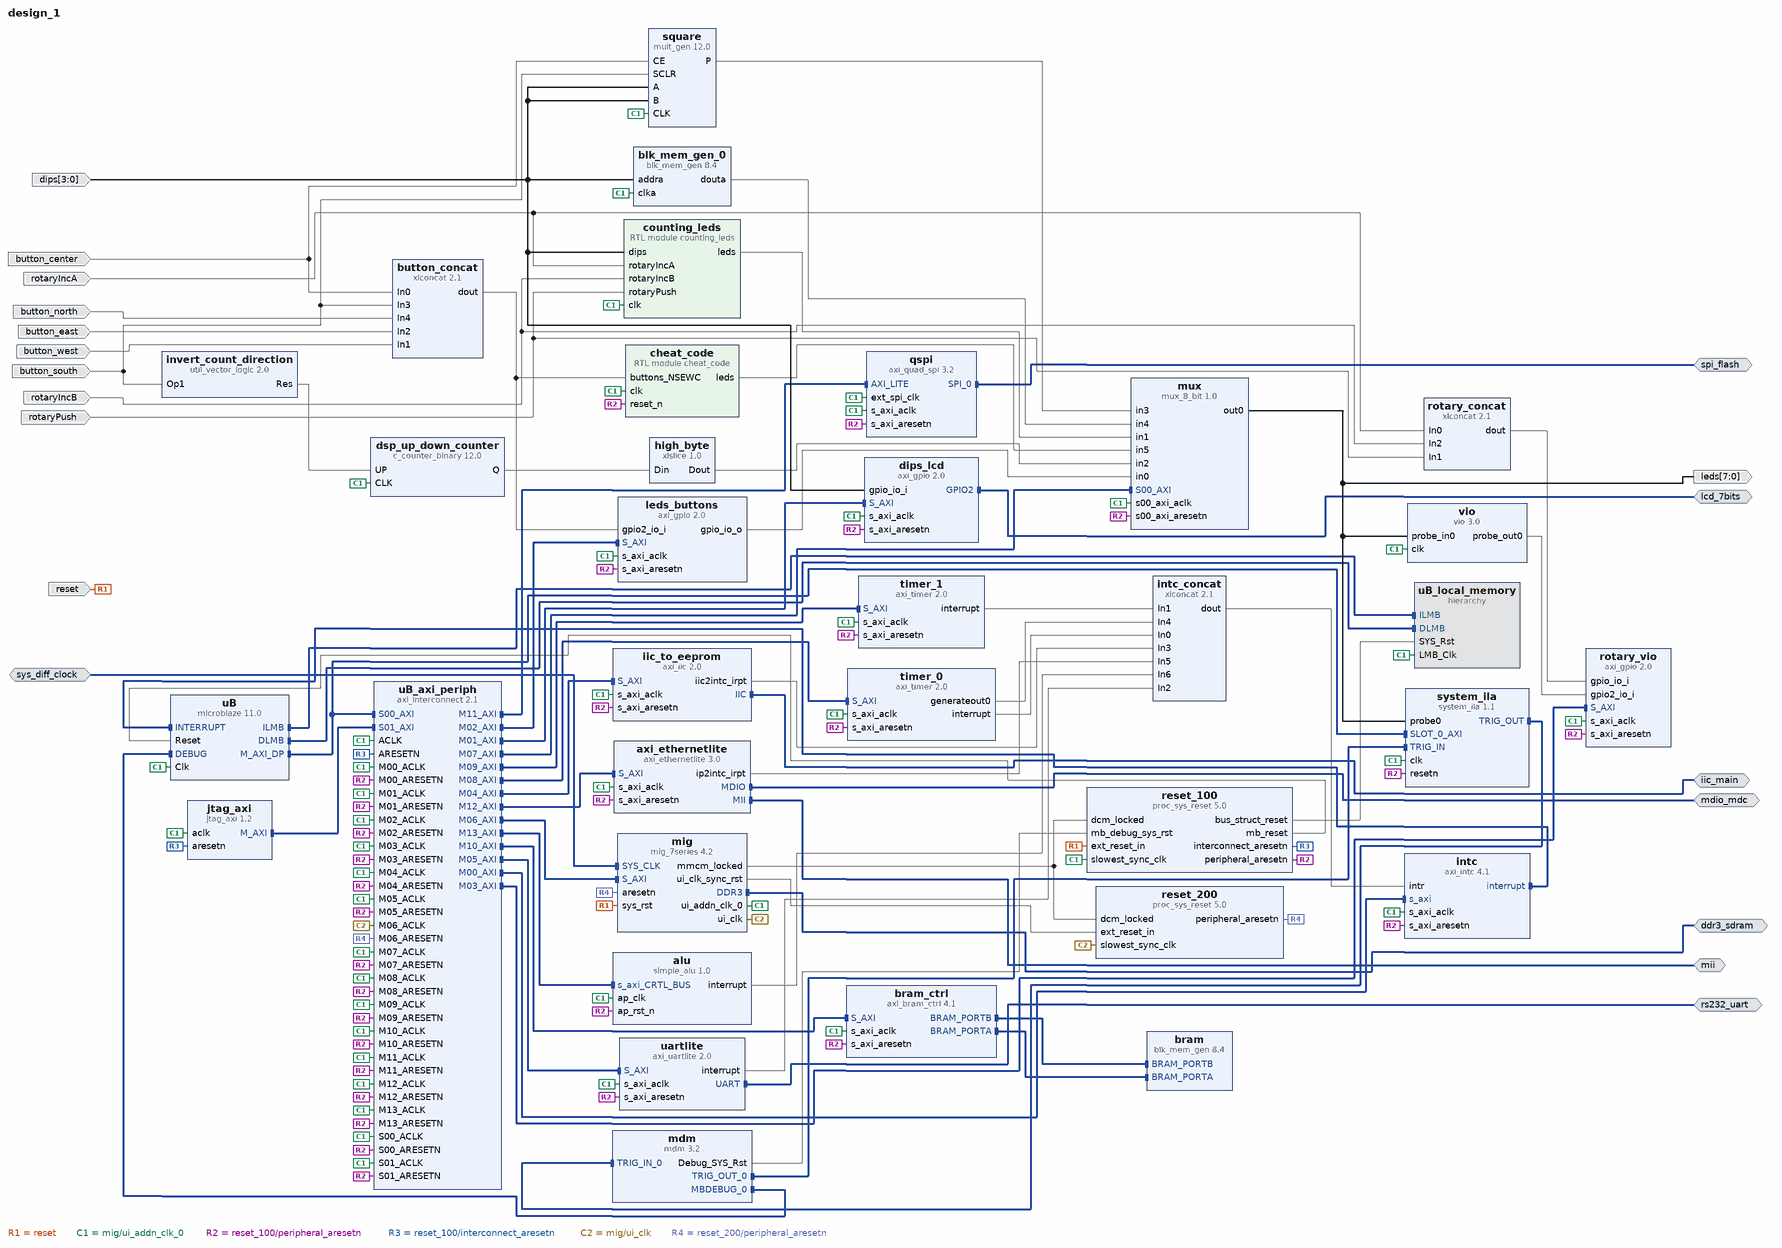
[diagram p0: block diagram of the top level]
# Vivado block design design_1, xc7k325tffg900-2, Vivado 2020.1
create_bd_design design_1

create_bd_intf_port -mode Master -vlnv xilinx.com:interface:gpio_rtl:1.0 lcd_7bits
create_bd_intf_port -mode Master -vlnv xilinx.com:interface:iic_rtl:1.0 iic_main
create_bd_intf_port -mode Master -vlnv xilinx.com:interface:uart_rtl:1.0 rs232_uart
create_bd_intf_port -mode Slave -vlnv xilinx.com:interface:diff_clock_rtl:1.0 sys_diff_clock
set_property -dict {CONFIG.FREQ_HZ 200000000} [get_bd_intf_ports sys_diff_clock]
create_bd_intf_port -mode Master -vlnv xilinx.com:interface:spi_rtl:1.0 spi_flash
create_bd_intf_port -mode Master -vlnv xilinx.com:interface:ddrx_rtl:1.0 ddr3_sdram
create_bd_intf_port -mode Master -vlnv xilinx.com:interface:mdio_rtl:1.0 mdio_mdc
create_bd_intf_port -mode Master -vlnv xilinx.com:interface:mii_rtl:1.0 mii
create_bd_port -dir I -type rst reset
set_property -dict {CONFIG.POLARITY ACTIVE_HIGH} [get_bd_ports reset]
create_bd_port -dir O -from 7 -to 0 leds
create_bd_port -dir I -from 3 -to 0 dips
create_bd_port -dir I rotaryIncA
create_bd_port -dir I rotaryIncB
create_bd_port -dir I rotaryPush
create_bd_port -dir I -type data button_south
create_bd_port -dir I -type data button_north
create_bd_port -dir I -type data button_east
create_bd_port -dir I button_west
create_bd_port -dir I -type data button_center

create_bd_cell -type ip -vlnv xilinx.com:ip:axi_gpio:2.0 dips_lcd
set_property -dict [list \
  CONFIG.GPIO2_BOARD_INTERFACE lcd_7bits \
  CONFIG.GPIO_BOARD_INTERFACE Custom \
  CONFIG.USE_BOARD_FLOW true \
] [get_bd_cells dips_lcd]
create_bd_cell -type ip -vlnv xilinx.com:ip:axi_gpio:2.0 leds_buttons
set_property -dict [list \
  CONFIG.GPIO2_BOARD_INTERFACE Custom \
  CONFIG.GPIO_BOARD_INTERFACE Custom \
  CONFIG.USE_BOARD_FLOW true \
] [get_bd_cells leds_buttons]
create_bd_cell -type ip -vlnv xilinx.com:ip:axi_iic:2.0 iic_to_eeprom
set_property -dict {CONFIG.IIC_BOARD_INTERFACE iic_main CONFIG.USE_BOARD_FLOW true} [get_bd_cells iic_to_eeprom]
create_bd_cell -type ip -vlnv xilinx.com:ip:axi_uartlite:2.0 uartlite
set_property -dict [list \
  CONFIG.C_BAUDRATE 115200 \
  CONFIG.UARTLITE_BOARD_INTERFACE rs232_uart \
  CONFIG.USE_BOARD_FLOW true \
] [get_bd_cells uartlite]
create_bd_cell -type ip -vlnv xilinx.com:ip:microblaze:11.0 uB
set_property -dict [list \
  CONFIG.C_ADDR_TAG_BITS 0 \
  CONFIG.C_DCACHE_ADDR_TAG 0 \
  CONFIG.C_DEBUG_ENABLED 2 \
  CONFIG.C_D_AXI 1 \
  CONFIG.C_D_LMB 1 \
  CONFIG.C_ENABLE_DISCRETE_PORTS 0 \
  CONFIG.C_I_LMB 1 \
  CONFIG.C_USE_BARREL 1 \
  CONFIG.C_USE_DCACHE 0 \
  CONFIG.C_USE_ICACHE 0 \
] [get_bd_cells uB]
create_bd_cell -type hier uB_local_memory
create_bd_cell -type ip -vlnv xilinx.com:ip:axi_interconnect:2.1 uB_axi_periph
set_property -dict {CONFIG.NUM_MI 14 CONFIG.NUM_SI 2} [get_bd_cells uB_axi_periph]
create_bd_cell -type ip -vlnv xilinx.com:ip:mdm:3.2 mdm
set_property -dict {CONFIG.C_ADDR_SIZE 32 CONFIG.C_M_AXI_ADDR_WIDTH 32 CONFIG.C_USE_CROSS_TRIGGER 1} [get_bd_cells mdm]
create_bd_cell -type ip -vlnv xilinx.com:ip:proc_sys_reset:5.0 reset_100
create_bd_cell -type ip -vlnv xilinx.com:ip:axi_timer:2.0 timer_0
create_bd_cell -type ip -vlnv xilinx.com:ip:axi_timer:2.0 timer_1
create_bd_cell -type ip -vlnv xilinx.com:ip:xlconcat:2.1 rotary_concat
set_property -dict {CONFIG.NUM_PORTS 3} [get_bd_cells rotary_concat]
create_bd_cell -type ip -vlnv xilinx.com:ip:axi_gpio:2.0 rotary_vio
set_property -dict [list \
  CONFIG.C_ALL_INPUTS 1 \
  CONFIG.C_ALL_INPUTS_2 1 \
  CONFIG.C_GPIO2_WIDTH 8 \
  CONFIG.C_GPIO_WIDTH 3 \
  CONFIG.C_IS_DUAL 1 \
] [get_bd_cells rotary_vio]
create_bd_cell -type ip -vlnv xilinx.com:ip:jtag_axi:1.2 jtag_axi
create_bd_cell -type ip -vlnv xilinx.com:ip:axi_bram_ctrl:4.1 bram_ctrl
create_bd_cell -type ip -vlnv xilinx.com:ip:blk_mem_gen:8.4 bram
set_property -dict {CONFIG.Memory_Type True_Dual_Port_RAM} [get_bd_cells bram]
create_bd_cell -type ip -vlnv xilinx.com:ip:axi_quad_spi:3.2 qspi
set_property -dict {CONFIG.QSPI_BOARD_INTERFACE spi_flash CONFIG.USE_BOARD_FLOW true} [get_bd_cells qspi]
create_bd_cell -type ip -vlnv xilinx.com:ip:axi_intc:4.1 intc
create_bd_cell -type ip -vlnv xilinx.com:ip:xlconcat:2.1 intc_concat
set_property -dict {CONFIG.NUM_PORTS 7} [get_bd_cells intc_concat]
create_bd_cell -type ip -vlnv xilinx.com:ip:mig_7series:4.2 mig
set_property -dict {CONFIG.BOARD_MIG_PARAM ddr3_sdram} [get_bd_cells mig]
create_bd_cell -type ip -vlnv xilinx.com:ip:proc_sys_reset:5.0 reset_200
set_property -dict [list \
  CONFIG.C_AUX_RESET_HIGH 0 \
  CONFIG.C_EXT_RST_WIDTH 4 \
  CONFIG.RESET_BOARD_INTERFACE Custom \
] [get_bd_cells reset_200]
create_bd_cell -type ip -vlnv xilinx.com:ip:vio:3.0 vio
set_property -dict [list \
  CONFIG.C_EN_PROBE_IN_ACTIVITY 0 \
  CONFIG.C_NUM_PROBE_IN 1 \
  CONFIG.C_NUM_PROBE_OUT 1 \
  CONFIG.C_PROBE_OUT0_INIT_VAL 0xA5 \
  CONFIG.C_PROBE_OUT0_WIDTH 8 \
] [get_bd_cells vio]
create_bd_cell -type ip -vlnv xilinx.com:ip:c_counter_binary:12.0 dsp_up_down_counter
set_property -dict [list \
  CONFIG.Count_Mode UPDOWN \
  CONFIG.Implementation DSP48 \
  CONFIG.Increment_Value 1 \
  CONFIG.Load false \
  CONFIG.Output_Width 32 \
  CONFIG.Restrict_Count false \
] [get_bd_cells dsp_up_down_counter]
create_bd_cell -type ip -vlnv xilinx.com:ip:xlslice:1.0 high_byte
set_property -dict {CONFIG.DIN_FROM 31 CONFIG.DIN_TO 24 CONFIG.DOUT_WIDTH 8} [get_bd_cells high_byte]
create_bd_cell -type ip -vlnv xilinx.com:ip:axi_ethernetlite:3.0 axi_ethernetlite
set_property -dict [list \
  CONFIG.C_INCLUDE_INTERNAL_LOOPBACK 1 \
  CONFIG.MDIO_BOARD_INTERFACE mdio_mdc \
  CONFIG.MII_BOARD_INTERFACE mii \
  CONFIG.USE_BOARD_FLOW true \
] [get_bd_cells axi_ethernetlite]
create_bd_cell -type ip -vlnv xilinx.com:ip:mult_gen:12.0 square
set_property -dict [list \
  CONFIG.ClockEnable true \
  CONFIG.MultType Parallel_Multiplier \
  CONFIG.Multiplier_Construction Use_Mults \
  CONFIG.PortAType Unsigned \
  CONFIG.PortAWidth 4 \
  CONFIG.PortBType Unsigned \
  CONFIG.PortBWidth 4 \
  CONFIG.SyncClear true \
] [get_bd_cells square]
create_bd_cell -type ip -vlnv xilinx.com:ip:xlconcat:2.1 button_concat
set_property -dict {CONFIG.NUM_PORTS 5} [get_bd_cells button_concat]
create_bd_cell -type ip -vlnv xilinx.com:ip:system_ila:1.1 system_ila
set_property -dict [list \
  CONFIG.ALL_PROBE_SAME_MU false \
  CONFIG.ALL_PROBE_SAME_MU_CNT 2 \
  CONFIG.C_ADV_TRIGGER true \
  CONFIG.C_EN_STRG_QUAL 1 \
  CONFIG.C_MON_TYPE MIX \
  CONFIG.C_NUM_MONITOR_SLOTS 1 \
  CONFIG.C_NUM_OF_PROBES 1 \
  CONFIG.C_PROBE0_MU_CNT 2 \
  CONFIG.C_PROBE0_WIDTH 8 \
  CONFIG.C_PROBE1_MU_CNT 2 \
  CONFIG.C_PROBE1_WIDTH 1 \
  CONFIG.C_PROBE_WIDTH_PROPAGATION MANUAL \
  CONFIG.C_SLOT 0 \
  CONFIG.C_SLOT_1_INTF_TYPE xilinx.com:interface:mii_rtl:1.0 \
  CONFIG.C_TRIGIN_EN true \
  CONFIG.C_TRIGOUT_EN true \
] [get_bd_cells system_ila]
create_bd_cell -type ip -vlnv xilinx.com:ip:util_vector_logic:2.0 invert_count_direction
set_property -dict {CONFIG.C_OPERATION not CONFIG.C_SIZE 1} [get_bd_cells invert_count_direction]
create_bd_cell -type ip -vlnv wbbinc.com:ip_repo:mux_8_bit:1.0 mux
create_bd_cell -type ip -vlnv wbbinc.com:simple-alu:simple_alu:1.0 alu
create_bd_cell -type ip -vlnv xilinx.com:ip:blk_mem_gen:8.4 blk_mem_gen_0
set_property -dict [list \
  CONFIG.Algorithm Fixed_Primitives \
  CONFIG.Coe_File ../../../../RTL/rom_data.coe \
  CONFIG.Enable_32bit_Address false \
  CONFIG.Enable_A Always_Enabled \
  CONFIG.Fill_Remaining_Memory_Locations true \
  CONFIG.Load_Init_File true \
  CONFIG.Memory_Type Single_Port_ROM \
  CONFIG.Port_A_Write_Rate 0 \
  CONFIG.Primitive 2kx9 \
  CONFIG.Register_PortA_Output_of_Memory_Primitives true \
  CONFIG.Use_RSTA_Pin false \
  CONFIG.Write_Depth_A 16 \
  CONFIG.Write_Width_A 8 \
  CONFIG.use_bram_block Stand_Alone \
] [get_bd_cells blk_mem_gen_0]
create_bd_cell -type module -reference counting_leds counting_leds
create_bd_cell -type module -reference cheat_code cheat_code

# ---- hierarchy /uB_local_memory ----
current_bd_instance /uB_local_memory
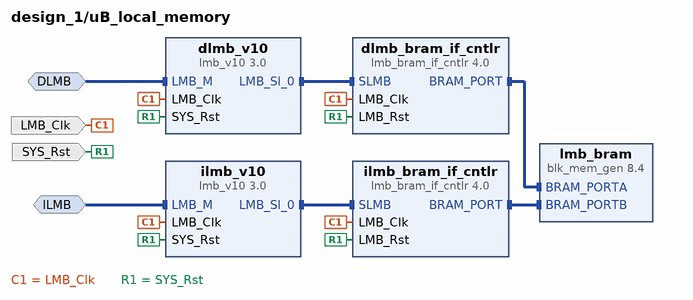
[diagram p1: block diagram inside /uB_local_memory]
create_bd_intf_pin -mode MirroredMaster -vlnv xilinx.com:interface:lmb_rtl:1.0 DLMB
create_bd_intf_pin -mode MirroredMaster -vlnv xilinx.com:interface:lmb_rtl:1.0 ILMB
create_bd_pin -dir I -type clk LMB_Clk
create_bd_pin -dir I -type rst SYS_Rst

create_bd_cell -type ip -vlnv xilinx.com:ip:lmb_v10:3.0 dlmb_v10
create_bd_cell -type ip -vlnv xilinx.com:ip:lmb_v10:3.0 ilmb_v10
create_bd_cell -type ip -vlnv xilinx.com:ip:lmb_bram_if_cntlr:4.0 dlmb_bram_if_cntlr
set_property -dict {CONFIG.C_ECC 0} [get_bd_cells dlmb_bram_if_cntlr]
create_bd_cell -type ip -vlnv xilinx.com:ip:lmb_bram_if_cntlr:4.0 ilmb_bram_if_cntlr
set_property -dict {CONFIG.C_ECC 0} [get_bd_cells ilmb_bram_if_cntlr]
create_bd_cell -type ip -vlnv xilinx.com:ip:blk_mem_gen:8.4 lmb_bram
set_property -dict {CONFIG.Memory_Type True_Dual_Port_RAM CONFIG.use_bram_block BRAM_Controller} [get_bd_cells lmb_bram]

# ---- connections ----

current_bd_instance /uB_local_memory
connect_bd_intf_net -intf_net microblaze_0_ilmb [get_bd_intf_pins ILMB] [get_bd_intf_pins ilmb_v10/LMB_M]
connect_bd_intf_net -intf_net microblaze_0_ilmb_cntlr [get_bd_intf_pins ilmb_bram_if_cntlr/BRAM_PORT] [get_bd_intf_pins lmb_bram/BRAM_PORTB]
connect_bd_intf_net -intf_net microblaze_0_dlmb_bus [get_bd_intf_pins dlmb_v10/LMB_Sl_0] [get_bd_intf_pins dlmb_bram_if_cntlr/SLMB]
connect_bd_intf_net -intf_net microblaze_0_dlmb_cntlr [get_bd_intf_pins dlmb_bram_if_cntlr/BRAM_PORT] [get_bd_intf_pins lmb_bram/BRAM_PORTA]
connect_bd_intf_net -intf_net microblaze_0_ilmb_bus [get_bd_intf_pins ilmb_v10/LMB_Sl_0] [get_bd_intf_pins ilmb_bram_if_cntlr/SLMB]
connect_bd_intf_net -intf_net microblaze_0_dlmb [get_bd_intf_pins DLMB] [get_bd_intf_pins dlmb_v10/LMB_M]
connect_bd_net -net microblaze_0_Clk [get_bd_pins LMB_Clk] \
  [get_bd_pins dlmb_v10/LMB_Clk] [get_bd_pins dlmb_bram_if_cntlr/LMB_Clk] [get_bd_pins ilmb_v10/LMB_Clk] \
  [get_bd_pins ilmb_bram_if_cntlr/LMB_Clk]
connect_bd_net [get_bd_pins SYS_Rst] \
  [get_bd_pins dlmb_v10/SYS_Rst] [get_bd_pins dlmb_bram_if_cntlr/LMB_Rst] [get_bd_pins ilmb_v10/SYS_Rst] \
  [get_bd_pins ilmb_bram_if_cntlr/LMB_Rst]
set_property HDL_ATTRIBUTE.BMM_INFO_ADDRESS_SPACE {byte  0x00000000 32 > design_1 uB_local_memory/lmb_bram} [get_bd_cells dlmb_bram_if_cntlr]
set_property HDL_ATTRIBUTE.KEEP_HIERARCHY yes [get_bd_cells dlmb_bram_if_cntlr]

current_bd_instance /
connect_bd_intf_net -intf_net axi_iic_0_IIC [get_bd_intf_ports iic_main] [get_bd_intf_pins iic_to_eeprom/IIC]
connect_bd_intf_net -intf_net axi_gpio_0_GPIO2 [get_bd_intf_ports lcd_7bits] [get_bd_intf_pins dips_lcd/GPIO2]
connect_bd_intf_net -intf_net microblaze_0_ilmb_1 [get_bd_intf_pins uB/ILMB] [get_bd_intf_pins uB_local_memory/ILMB]
connect_bd_intf_net -intf_net microblaze_0_dlmb_1 [get_bd_intf_pins uB/DLMB] [get_bd_intf_pins uB_local_memory/DLMB]
connect_bd_intf_net [get_bd_intf_pins uB_axi_periph/M09_AXI] [get_bd_intf_pins timer_1/S_AXI]
connect_bd_intf_net [get_bd_intf_pins uB_axi_periph/M11_AXI] [get_bd_intf_pins qspi/AXI_LITE]
connect_bd_intf_net -intf_net jtag_axi_0_M_AXI [get_bd_intf_pins jtag_axi/M_AXI] [get_bd_intf_pins uB_axi_periph/S01_AXI]
connect_bd_intf_net -intf_net system_ila_0_TRIG_OUT [get_bd_intf_pins mdm/TRIG_IN_0] [get_bd_intf_pins system_ila/TRIG_OUT]
connect_bd_intf_net -intf_net axi_intc_0_interrupt [get_bd_intf_pins intc/interrupt] [get_bd_intf_pins uB/INTERRUPT]
connect_bd_intf_net [get_bd_intf_pins uB_axi_periph/M13_AXI] [get_bd_intf_pins alu/s_axi_CRTL_BUS]
connect_bd_intf_net [get_bd_intf_pins uB_axi_periph/M07_AXI] [get_bd_intf_pins mux/S00_AXI]
connect_bd_intf_net -intf_net axi_ethernetlite_0_MDIO [get_bd_intf_ports mdio_mdc] [get_bd_intf_pins axi_ethernetlite/MDIO]
connect_bd_intf_net [get_bd_intf_pins mdm/TRIG_OUT_0] [get_bd_intf_pins system_ila/TRIG_IN]
connect_bd_intf_net [get_bd_intf_pins uB_axi_periph/M06_AXI] [get_bd_intf_pins mig/S_AXI]
connect_bd_intf_net [get_bd_intf_pins uB_axi_periph/M00_AXI] [get_bd_intf_pins intc/s_axi]
connect_bd_intf_net [get_bd_intf_ports sys_diff_clock] [get_bd_intf_pins mig/SYS_CLK]
connect_bd_intf_net [get_bd_intf_pins uB_axi_periph/M04_AXI] [get_bd_intf_pins iic_to_eeprom/S_AXI]
connect_bd_intf_net [get_bd_intf_pins uB_axi_periph/M08_AXI] [get_bd_intf_pins timer_0/S_AXI]
connect_bd_intf_net -intf_net axi_uartlite_0_UART [get_bd_intf_ports rs232_uart] [get_bd_intf_pins uartlite/UART]
connect_bd_intf_net [get_bd_intf_pins uB_axi_periph/M01_AXI] [get_bd_intf_pins dips_lcd/S_AXI]
connect_bd_intf_net -intf_net microblaze_0_debug [get_bd_intf_pins mdm/MBDEBUG_0] [get_bd_intf_pins uB/DEBUG]
connect_bd_intf_net -intf_net microblaze_0_axi_dp [get_bd_intf_pins uB_axi_periph/S00_AXI] [get_bd_intf_pins uB/M_AXI_DP]
connect_bd_intf_net [get_bd_intf_pins uB_axi_periph/S00_AXI] [get_bd_intf_pins system_ila/SLOT_0_AXI]
connect_bd_intf_net [get_bd_intf_pins uB_axi_periph/M03_AXI] [get_bd_intf_pins rotary_vio/S_AXI]
connect_bd_intf_net -intf_net axi_bram_ctrl_0_BRAM_PORTB [get_bd_intf_pins bram/BRAM_PORTB] [get_bd_intf_pins bram_ctrl/BRAM_PORTB]
connect_bd_intf_net -intf_net axi_bram_ctrl_0_BRAM_PORTA [get_bd_intf_pins bram/BRAM_PORTA] [get_bd_intf_pins bram_ctrl/BRAM_PORTA]
connect_bd_intf_net -intf_net mig_7series_0_DDR3 [get_bd_intf_ports ddr3_sdram] [get_bd_intf_pins mig/DDR3]
connect_bd_intf_net [get_bd_intf_pins uB_axi_periph/M12_AXI] [get_bd_intf_pins axi_ethernetlite/S_AXI]
connect_bd_intf_net [get_bd_intf_ports mii] [get_bd_intf_pins axi_ethernetlite/MII]
connect_bd_intf_net -intf_net axi_quad_spi_0_SPI_0 [get_bd_intf_ports spi_flash] [get_bd_intf_pins qspi/SPI_0]
connect_bd_intf_net [get_bd_intf_pins uB_axi_periph/M10_AXI] [get_bd_intf_pins bram_ctrl/S_AXI]
connect_bd_intf_net [get_bd_intf_pins uB_axi_periph/M05_AXI] [get_bd_intf_pins uartlite/S_AXI]
connect_bd_intf_net [get_bd_intf_pins uB_axi_periph/M02_AXI] [get_bd_intf_pins leds_buttons/S_AXI]
connect_bd_net [get_bd_ports reset] [get_bd_pins reset_100/ext_reset_in] [get_bd_pins mig/sys_rst]
connect_bd_net -net microblaze_0_Clk_1 [get_bd_pins mig/ui_addn_clk_0] \
  [get_bd_pins uB/Clk] [get_bd_pins uB_axi_periph/ACLK] [get_bd_pins uB_axi_periph/S00_ACLK] \
  [get_bd_pins uB_axi_periph/M00_ACLK] [get_bd_pins uB_local_memory/LMB_Clk] [get_bd_pins reset_100/slowest_sync_clk] \
  [get_bd_pins dips_lcd/s_axi_aclk] [get_bd_pins leds_buttons/s_axi_aclk] [get_bd_pins uartlite/s_axi_aclk] \
  [get_bd_pins iic_to_eeprom/s_axi_aclk] [get_bd_pins uB_axi_periph/M01_ACLK] [get_bd_pins uB_axi_periph/M02_ACLK] \
  [get_bd_pins uB_axi_periph/M03_ACLK] [get_bd_pins uB_axi_periph/M04_ACLK] [get_bd_pins uB_axi_periph/M05_ACLK] \
  [get_bd_pins uB_axi_periph/S01_ACLK] [get_bd_pins uB_axi_periph/M07_ACLK] [get_bd_pins timer_0/s_axi_aclk] \
  [get_bd_pins uB_axi_periph/M08_ACLK] [get_bd_pins timer_1/s_axi_aclk] [get_bd_pins uB_axi_periph/M09_ACLK] \
  [get_bd_pins rotary_vio/s_axi_aclk] [get_bd_pins jtag_axi/aclk] [get_bd_pins bram_ctrl/s_axi_aclk] \
  [get_bd_pins uB_axi_periph/M10_ACLK] [get_bd_pins uB_axi_periph/M11_ACLK] [get_bd_pins qspi/s_axi_aclk] \
  [get_bd_pins qspi/ext_spi_clk] [get_bd_pins intc/s_axi_aclk] [get_bd_pins vio/clk] [get_bd_pins dsp_up_down_counter/CLK] \
  [get_bd_pins axi_ethernetlite/s_axi_aclk] [get_bd_pins uB_axi_periph/M12_ACLK] [get_bd_pins square/CLK] \
  [get_bd_pins system_ila/clk] [get_bd_pins uB_axi_periph/M13_ACLK] [get_bd_pins mux/s00_axi_aclk] [get_bd_pins alu/ap_clk] \
  [get_bd_pins blk_mem_gen_0/clka] [get_bd_pins counting_leds/clk] [get_bd_pins cheat_code/clk]
connect_bd_net -net rst_clk_wiz_0_100M_mb_reset [get_bd_pins reset_100/mb_reset] [get_bd_pins uB/Reset]
connect_bd_net -net rst_clk_wiz_0_100M_bus_struct_reset [get_bd_pins reset_100/bus_struct_reset] [get_bd_pins uB_local_memory/SYS_Rst]
connect_bd_net -net rst_clk_wiz_0_100M_peripheral_aresetn1 [get_bd_pins reset_100/peripheral_aresetn] \
  [get_bd_pins uB_axi_periph/S00_ARESETN] [get_bd_pins uB_axi_periph/M00_ARESETN] [get_bd_pins dips_lcd/s_axi_aresetn] \
  [get_bd_pins leds_buttons/s_axi_aresetn] [get_bd_pins uartlite/s_axi_aresetn] [get_bd_pins iic_to_eeprom/s_axi_aresetn] \
  [get_bd_pins uB_axi_periph/M01_ARESETN] [get_bd_pins uB_axi_periph/M02_ARESETN] [get_bd_pins uB_axi_periph/M03_ARESETN] \
  [get_bd_pins uB_axi_periph/M04_ARESETN] [get_bd_pins uB_axi_periph/M05_ARESETN] [get_bd_pins uB_axi_periph/S01_ARESETN] \
  [get_bd_pins uB_axi_periph/M07_ARESETN] [get_bd_pins timer_0/s_axi_aresetn] [get_bd_pins uB_axi_periph/M08_ARESETN] \
  [get_bd_pins timer_1/s_axi_aresetn] [get_bd_pins uB_axi_periph/M09_ARESETN] [get_bd_pins rotary_vio/s_axi_aresetn] \
  [get_bd_pins bram_ctrl/s_axi_aresetn] [get_bd_pins uB_axi_periph/M10_ARESETN] [get_bd_pins uB_axi_periph/M11_ARESETN] \
  [get_bd_pins qspi/s_axi_aresetn] [get_bd_pins intc/s_axi_aresetn] [get_bd_pins axi_ethernetlite/s_axi_aresetn] \
  [get_bd_pins uB_axi_periph/M12_ARESETN] [get_bd_pins system_ila/resetn] [get_bd_pins uB_axi_periph/M13_ARESETN] \
  [get_bd_pins mux/s00_axi_aresetn] [get_bd_pins alu/ap_rst_n] [get_bd_pins cheat_code/reset_n]
connect_bd_net -net mdm_1_debug_sys_rst [get_bd_pins mdm/Debug_SYS_Rst] [get_bd_pins reset_100/mb_debug_sys_rst]
connect_bd_net -net axi_timer_0_generateout0 [get_bd_pins timer_0/generateout0] [get_bd_pins intc_concat/In4]
connect_bd_net -net axi_uartlite_0_interrupt [get_bd_pins uartlite/interrupt] [get_bd_pins intc_concat/In2]
connect_bd_net -net axi_iic_0_iic2intc_irpt [get_bd_pins iic_to_eeprom/iic2intc_irpt] [get_bd_pins intc_concat/In3]
connect_bd_net -net axi_timer_0_interrupt [get_bd_pins timer_0/interrupt] [get_bd_pins intc_concat/In0]
connect_bd_net -net axi_timer_1_interrupt [get_bd_pins timer_1/interrupt] [get_bd_pins intc_concat/In1]
connect_bd_net -net Din_0_1 [get_bd_ports dips] \
  [get_bd_pins dips_lcd/gpio_io_i] [get_bd_pins square/A] [get_bd_pins square/B] [get_bd_pins blk_mem_gen_0/addra] \
  [get_bd_pins counting_leds/dips]
connect_bd_net -net rotaryIncA_0_1 [get_bd_ports rotaryIncA] [get_bd_pins rotary_concat/In0] [get_bd_pins counting_leds/rotaryIncA]
connect_bd_net -net rotaryIncB_0_1 [get_bd_ports rotaryIncB] [get_bd_pins rotary_concat/In2] [get_bd_pins counting_leds/rotaryIncB]
connect_bd_net -net rotaryPush_0_1 [get_bd_ports rotaryPush] [get_bd_pins rotary_concat/In1] [get_bd_pins counting_leds/rotaryPush]
connect_bd_net -net xlconcat_0_dout [get_bd_pins rotary_concat/dout] [get_bd_pins rotary_vio/gpio_io_i]
connect_bd_net -net counting_leds_0_leds [get_bd_pins counting_leds/leds] [get_bd_pins mux/in1]
connect_bd_net -net axi_gpio_1_gpio_io_o [get_bd_pins leds_buttons/gpio_io_o] [get_bd_pins mux/in0]
connect_bd_net -net rst_clk_wiz_0_100M_interconnect_aresetn [get_bd_pins reset_100/interconnect_aresetn] \
  [get_bd_pins jtag_axi/aresetn] [get_bd_pins uB_axi_periph/ARESETN]
connect_bd_net -net mig_7series_0_ui_clk [get_bd_pins mig/ui_clk] [get_bd_pins reset_200/slowest_sync_clk] [get_bd_pins uB_axi_periph/M06_ACLK]
connect_bd_net -net mig_7series_0_mmcm_locked [get_bd_pins mig/mmcm_locked] [get_bd_pins reset_200/dcm_locked] [get_bd_pins reset_100/dcm_locked]
connect_bd_net -net mig_7series_0_ui_clk_sync_rst [get_bd_pins mig/ui_clk_sync_rst] [get_bd_pins reset_200/ext_reset_in]
connect_bd_net -net rst_200M_peripheral_aresetn [get_bd_pins reset_200/peripheral_aresetn] \
  [get_bd_pins uB_axi_periph/M06_ARESETN] [get_bd_pins mig/aresetn]
connect_bd_net [get_bd_pins intc_concat/dout] [get_bd_pins intc/intr]
connect_bd_net -net vio_0_probe_out0 [get_bd_pins vio/probe_out0] [get_bd_pins rotary_vio/gpio2_io_i]
connect_bd_net -net c_counter_binary_0_Q [get_bd_pins dsp_up_down_counter/Q] [get_bd_pins high_byte/Din]
connect_bd_net -net xlslice_0_Dout [get_bd_pins high_byte/Dout] [get_bd_pins mux/in2]
connect_bd_net -net axi_ethernetlite_0_ip2intc_irpt [get_bd_pins axi_ethernetlite/ip2intc_irpt] [get_bd_pins intc_concat/In5]
connect_bd_net [get_bd_pins square/P] [get_bd_pins mux/in3]
connect_bd_net [get_bd_pins button_concat/dout] [get_bd_pins leds_buttons/gpio2_io_i] [get_bd_pins cheat_code/buttons_NSEWC]
connect_bd_net [get_bd_ports button_south] [get_bd_pins button_concat/In3] [get_bd_pins square/SCLR] [get_bd_pins invert_count_direction/Op1]
connect_bd_net [get_bd_ports button_north] [get_bd_pins button_concat/In4]
connect_bd_net [get_bd_ports button_east] [get_bd_pins button_concat/In2]
connect_bd_net [get_bd_ports button_west] [get_bd_pins button_concat/In1]
connect_bd_net [get_bd_ports button_center] [get_bd_pins button_concat/In0] [get_bd_pins square/CE]
connect_bd_net -net invert_down_button_Res [get_bd_pins invert_count_direction/Res] [get_bd_pins dsp_up_down_counter/UP]
connect_bd_net -net mux_8_bit_0_out0 [get_bd_pins mux/out0] [get_bd_ports leds] [get_bd_pins vio/probe_in0] [get_bd_pins system_ila/probe0]
connect_bd_net [get_bd_pins alu/interrupt] [get_bd_pins intc_concat/In6]
connect_bd_net [get_bd_pins cheat_code/leds] [get_bd_pins mux/in5]
connect_bd_net [get_bd_pins blk_mem_gen_0/douta] [get_bd_pins mux/in4]
set_property HDL_ATTRIBUTE.BMM_INFO_PROCESSOR {microblaze-le > design_1 uB_local_memory/dlmb_bram_if_cntlr design_1 bram_ctrl} [get_bd_cells uB]
set_property HDL_ATTRIBUTE.KEEP_HIERARCHY yes [get_bd_cells uB]
set_property HDL_ATTRIBUTE.BMM_INFO_ADDRESS_SPACE {byte  0xC0000000 32 > design_1 bram} [get_bd_cells bram_ctrl]
set_property HDL_ATTRIBUTE.KEEP_HIERARCHY yes [get_bd_cells bram_ctrl]

# ---- address map ----
assign_bd_address -offset 0x40000000 -range 64K -target_address_space [get_bd_addr_spaces jtag_axi/Data] [get_bd_addr_segs dips_lcd/S_AXI/Reg]
assign_bd_address -offset 0x40010000 -range 64K -target_address_space [get_bd_addr_spaces jtag_axi/Data] [get_bd_addr_segs leds_buttons/S_AXI/Reg]
assign_bd_address -offset 0x40020000 -range 64K -target_address_space [get_bd_addr_spaces jtag_axi/Data] [get_bd_addr_segs rotary_vio/S_AXI/Reg]
assign_bd_address -offset 0x40600000 -range 64K -target_address_space [get_bd_addr_spaces jtag_axi/Data] [get_bd_addr_segs uartlite/S_AXI/Reg]
assign_bd_address -offset 0x40800000 -range 64K -target_address_space [get_bd_addr_spaces jtag_axi/Data] [get_bd_addr_segs iic_to_eeprom/S_AXI/Reg]
assign_bd_address -offset 0x40E00000 -range 64K -target_address_space [get_bd_addr_spaces jtag_axi/Data] [get_bd_addr_segs axi_ethernetlite/S_AXI/Reg]
assign_bd_address -offset 0x41200000 -range 64K -target_address_space [get_bd_addr_spaces jtag_axi/Data] [get_bd_addr_segs intc/S_AXI/Reg]
assign_bd_address -offset 0x41C00000 -range 64K -target_address_space [get_bd_addr_spaces jtag_axi/Data] [get_bd_addr_segs timer_0/S_AXI/Reg]
assign_bd_address -offset 0x41C10000 -range 64K -target_address_space [get_bd_addr_spaces jtag_axi/Data] [get_bd_addr_segs timer_1/S_AXI/Reg]
assign_bd_address -offset 0x44A00000 -range 64K -target_address_space [get_bd_addr_spaces jtag_axi/Data] [get_bd_addr_segs qspi/AXI_LITE/Reg]
assign_bd_address -offset 0x44A10000 -range 64K -target_address_space [get_bd_addr_spaces jtag_axi/Data] [get_bd_addr_segs mux/S00_AXI/S00_AXI_reg]
assign_bd_address -offset 0x44A20000 -range 64K -target_address_space [get_bd_addr_spaces jtag_axi/Data] [get_bd_addr_segs alu/s_axi_CRTL_BUS/Reg]
assign_bd_address -offset 0x80000000 -range 1G -target_address_space [get_bd_addr_spaces jtag_axi/Data] [get_bd_addr_segs mig/memmap/memaddr]
assign_bd_address -offset 0xC0000000 -range 8K -target_address_space [get_bd_addr_spaces jtag_axi/Data] [get_bd_addr_segs bram_ctrl/S_AXI/Mem0]
assign_bd_address -offset 0x00000000 -range 128K -target_address_space [get_bd_addr_spaces uB/Data] [get_bd_addr_segs uB_local_memory/dlmb_bram_if_cntlr/SLMB/Mem]
assign_bd_address -offset 0x40000000 -range 64K -target_address_space [get_bd_addr_spaces uB/Data] [get_bd_addr_segs dips_lcd/S_AXI/Reg]
assign_bd_address -offset 0x40010000 -range 64K -target_address_space [get_bd_addr_spaces uB/Data] [get_bd_addr_segs leds_buttons/S_AXI/Reg]
assign_bd_address -offset 0x40020000 -range 64K -target_address_space [get_bd_addr_spaces uB/Data] [get_bd_addr_segs rotary_vio/S_AXI/Reg]
assign_bd_address -offset 0x40600000 -range 64K -target_address_space [get_bd_addr_spaces uB/Data] [get_bd_addr_segs uartlite/S_AXI/Reg]
assign_bd_address -offset 0x40800000 -range 64K -target_address_space [get_bd_addr_spaces uB/Data] [get_bd_addr_segs iic_to_eeprom/S_AXI/Reg]
assign_bd_address -offset 0x40E00000 -range 64K -target_address_space [get_bd_addr_spaces uB/Data] [get_bd_addr_segs axi_ethernetlite/S_AXI/Reg]
assign_bd_address -offset 0x41200000 -range 64K -target_address_space [get_bd_addr_spaces uB/Data] [get_bd_addr_segs intc/S_AXI/Reg]
assign_bd_address -offset 0x41C00000 -range 64K -target_address_space [get_bd_addr_spaces uB/Data] [get_bd_addr_segs timer_0/S_AXI/Reg]
assign_bd_address -offset 0x41C10000 -range 64K -target_address_space [get_bd_addr_spaces uB/Data] [get_bd_addr_segs timer_1/S_AXI/Reg]
assign_bd_address -offset 0x44A00000 -range 64K -target_address_space [get_bd_addr_spaces uB/Data] [get_bd_addr_segs qspi/AXI_LITE/Reg]
assign_bd_address -offset 0x44A10000 -range 64K -target_address_space [get_bd_addr_spaces uB/Data] [get_bd_addr_segs mux/S00_AXI/S00_AXI_reg]
assign_bd_address -offset 0x44A20000 -range 64K -target_address_space [get_bd_addr_spaces uB/Data] [get_bd_addr_segs alu/s_axi_CRTL_BUS/Reg]
assign_bd_address -offset 0x80000000 -range 1G -target_address_space [get_bd_addr_spaces uB/Data] [get_bd_addr_segs mig/memmap/memaddr]
assign_bd_address -offset 0xC0000000 -range 8K -target_address_space [get_bd_addr_spaces uB/Data] [get_bd_addr_segs bram_ctrl/S_AXI/Mem0]
assign_bd_address -offset 0x00000000 -range 128K -target_address_space [get_bd_addr_spaces uB/Instruction] [get_bd_addr_segs uB_local_memory/ilmb_bram_if_cntlr/SLMB/Mem]

validate_bd_design
save_bd_design
